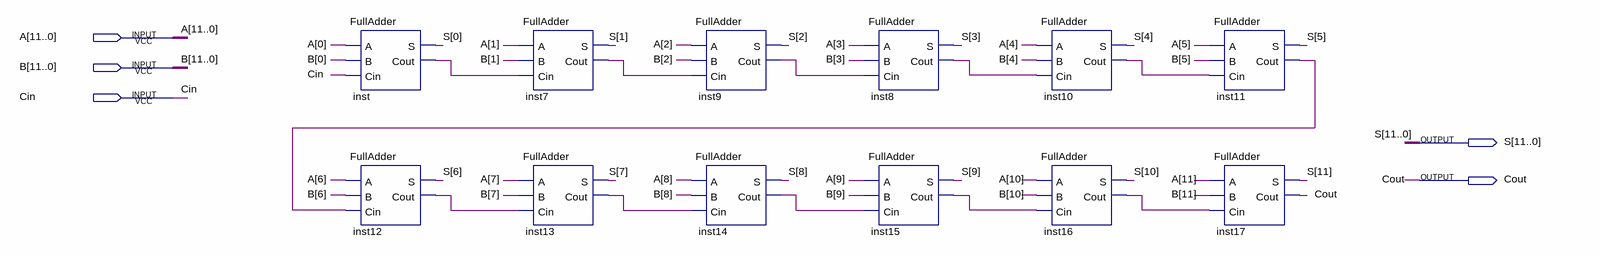
[diagram p0: schematic sheet]
// Quartus schematic sumador12bits.bdf as structural Verilog: 12 symbols, 5 pins
module sumador12bits (
  input  [11:0] A,
  input  [11:0] B,
  input  Cin,
  output [11:0] S,
  output Cout
);

  wire inst7_cout, inst8_cout, inst9_cout, inst10_cout, inst11_cout, inst12_cout, inst13_cout, inst14_cout,
       inst15_cout, inst16_cout, inst_cout;

  FullAdder inst (.A(A[0]), .B(B[0]), .Cin(Cin), .S(S[0]), .Cout(inst_cout));
  FullAdder inst12 (.A(A[6]), .B(B[6]), .Cin(inst11_cout), .S(S[6]), .Cout(inst12_cout));
  FullAdder inst7 (.A(A[1]), .B(B[1]), .Cin(inst_cout), .S(S[1]), .Cout(inst7_cout));
  FullAdder inst13 (.A(A[7]), .B(B[7]), .Cin(inst12_cout), .S(S[7]), .Cout(inst13_cout));
  FullAdder inst9 (.A(A[2]), .B(B[2]), .Cin(inst7_cout), .S(S[2]), .Cout(inst9_cout));
  FullAdder inst14 (.A(A[8]), .B(B[8]), .Cin(inst13_cout), .S(S[8]), .Cout(inst14_cout));
  FullAdder inst8 (.A(A[3]), .B(B[3]), .Cin(inst9_cout), .S(S[3]), .Cout(inst8_cout));
  FullAdder inst15 (.A(A[9]), .B(B[9]), .Cin(inst14_cout), .S(S[9]), .Cout(inst15_cout));
  FullAdder inst10 (.A(A[4]), .B(B[4]), .Cin(inst8_cout), .S(S[4]), .Cout(inst10_cout));
  FullAdder inst16 (.A(A[10]), .B(B[10]), .Cin(inst15_cout), .S(S[10]), .Cout(inst16_cout));
  FullAdder inst11 (.A(A[5]), .B(B[5]), .Cin(inst10_cout), .S(S[5]), .Cout(inst11_cout));
  FullAdder inst17 (.A(A[11]), .B(B[11]), .Cin(inst16_cout), .S(S[11]), .Cout(Cout));
endmodule
